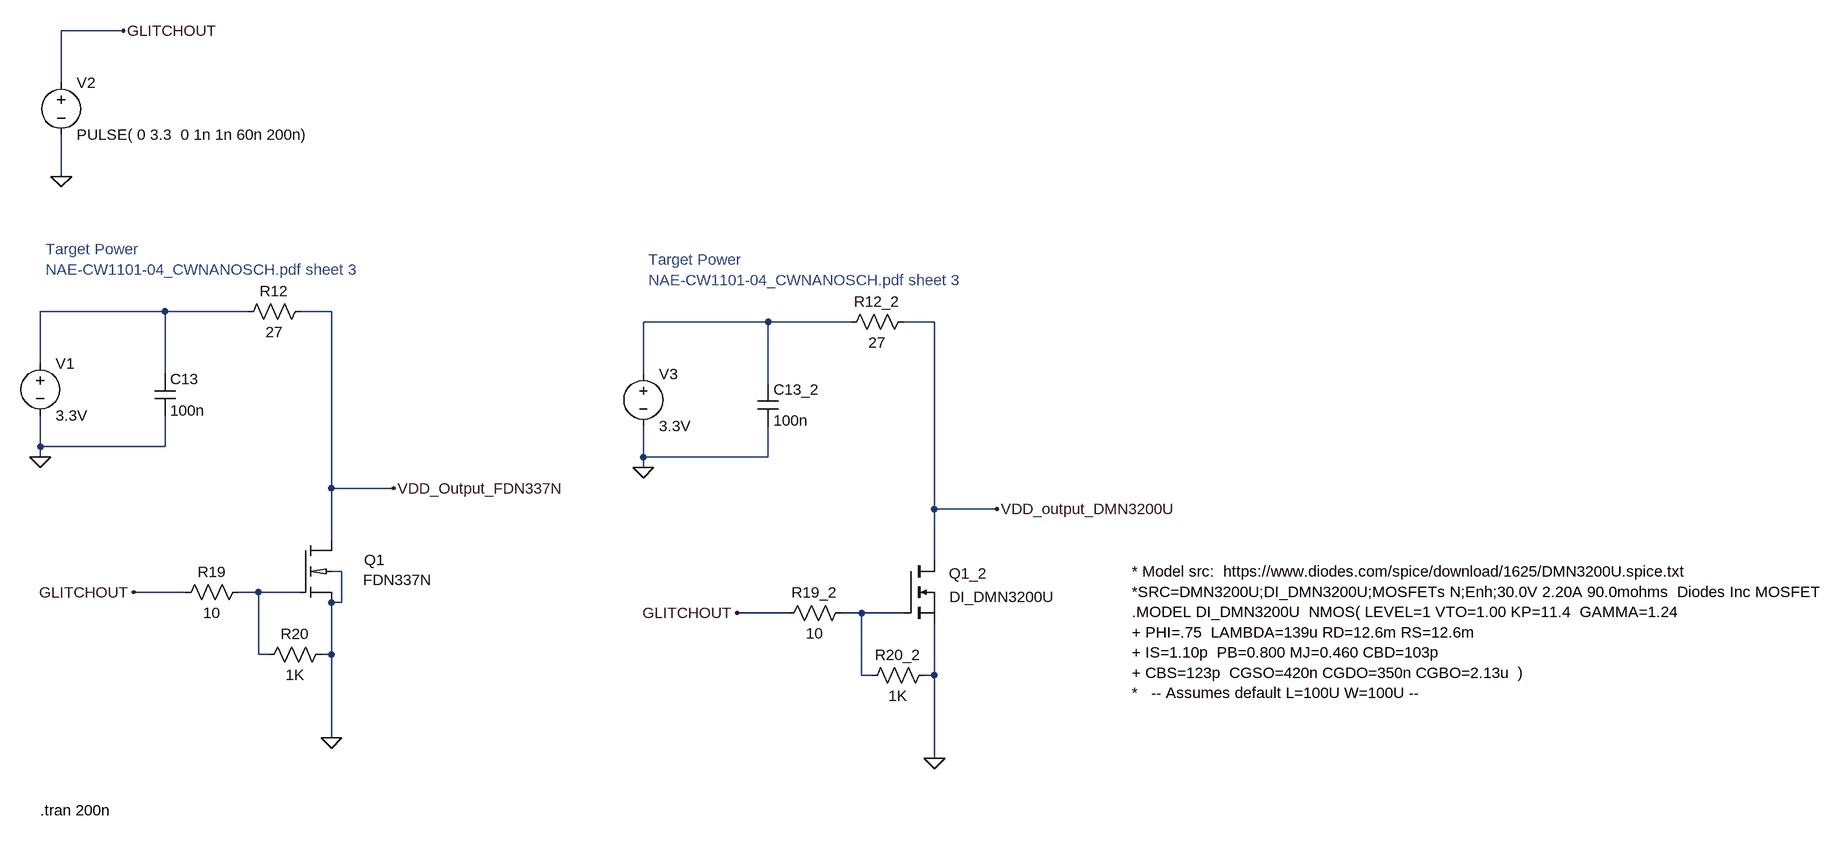
[diagram p0: schematic cw_nano_glitch_sim.asc]
cw_nano_glitch_sim.asc, the LTspice schematic file:
Version 4
SHEET 1 2692 1140
WIRE -592 -576 -688 -576
WIRE -688 -496 -688 -576
WIRE -688 -352 -688 -416
WIRE -528 -144 -720 -144
WIRE -400 -144 -528 -144
WIRE -272 -144 -320 -144
WIRE 400 -128 208 -128
WIRE 528 -128 400 -128
WIRE 656 -128 608 -128
WIRE -720 -64 -720 -144
WIRE -528 -48 -528 -144
WIRE 208 -48 208 -128
WIRE 400 -32 400 -128
WIRE -720 64 -720 16
WIRE -528 64 -528 16
WIRE -528 64 -720 64
WIRE -720 80 -720 64
WIRE 208 80 208 32
WIRE 400 80 400 32
WIRE 400 80 208 80
WIRE 208 96 208 80
WIRE -272 128 -272 -144
WIRE -176 128 -272 128
WIRE 656 160 656 -128
WIRE 752 160 656 160
WIRE -272 208 -272 128
WIRE 656 240 656 160
WIRE -256 256 -272 256
WIRE -496 288 -576 288
WIRE -384 288 -416 288
WIRE -320 288 -384 288
WIRE -256 304 -256 256
WIRE -256 304 -272 304
WIRE 432 320 352 320
WIRE 544 320 512 320
WIRE 608 320 544 320
WIRE -384 384 -384 288
WIRE -368 384 -384 384
WIRE -272 384 -272 304
WIRE -272 384 -288 384
WIRE 544 416 544 320
WIRE 560 416 544 416
WIRE 656 416 656 336
WIRE 656 416 640 416
WIRE -272 512 -272 384
WIRE 656 544 656 416
FLAG -720 80 0
FLAG -688 -352 0
FLAG -592 -576 GLITCHOUT
FLAG -176 128 VDD_Output_FDN337N
FLAG -272 512 0
FLAG 752 160 VDD_output_DMN3200U
FLAG 656 544 0
FLAG 208 96 0
FLAG 352 320 GLITCHOUT
FLAG -576 288 GLITCHOUT
SYMBOL voltage -720 -80 R0
WINDOW 123 0 0 Left 0
WINDOW 39 0 0 Left 0
SYMATTR InstName V1
SYMATTR Value 3.3V
SYMBOL voltage -688 -512 R0
WINDOW 123 0 0 Left 0
WINDOW 39 0 0 Left 0
SYMATTR InstName V2
SYMATTR Value PULSE( 0 3.3  0 1n 1n 60n 200n)
SYMBOL res -272 368 R90
WINDOW 0 0 56 VBottom 2
WINDOW 3 32 56 VTop 2
SYMATTR InstName R20
SYMATTR Value 1K
SYMBOL res -400 272 R90
WINDOW 0 0 56 VBottom 2
WINDOW 3 32 56 VTop 2
SYMATTR InstName R19
SYMATTR Value 10
SYMBOL cap -544 -48 R0
SYMATTR InstName C13
SYMATTR Value 100n
SYMBOL res -304 -160 R90
WINDOW 0 0 56 VBottom 2
WINDOW 3 32 56 VTop 2
SYMATTR InstName R12
SYMATTR Value 27
SYMBOL nmos 608 240 R0
WINDOW 0 130 19 Right 2
WINDOW 3 235 55 Right 2
SYMATTR InstName Q1_2
SYMATTR Value DI_DMN3200U
SYMBOL res 656 400 R90
WINDOW 0 0 56 VBottom 2
WINDOW 3 32 56 VTop 2
SYMATTR InstName R20_2
SYMATTR Value 1K
SYMBOL res 528 304 R90
WINDOW 0 0 56 VBottom 2
WINDOW 3 32 56 VTop 2
SYMATTR InstName R19_2
SYMATTR Value 10
SYMBOL voltage 208 -64 R0
WINDOW 123 0 0 Left 0
WINDOW 39 0 0 Left 0
SYMATTR InstName V3
SYMATTR Value 3.3V
SYMBOL cap 384 -32 R0
SYMATTR InstName C13_2
SYMATTR Value 100n
SYMBOL res 624 -144 R90
WINDOW 0 0 56 VBottom 2
WINDOW 3 32 56 VTop 2
SYMATTR InstName R12_2
SYMATTR Value 27
SYMBOL FDN337N -320 208 R0
WINDOW 0 98 30 Left 2
WINDOW 3 97 61 Left 2
SYMATTR InstName Q1
TEXT -720 624 Left 2 !.tran 200n
TEXT -712 -240 Left 2 ;Target Power \nNAE-CW1101-04_CWNANOSCH.pdf sheet 3
TEXT 216 -224 Left 2 ;Target Power \nNAE-CW1101-04_CWNANOSCH.pdf sheet 3
TEXT 960 256 Left 2 !* Model src:  https://www.diodes.com/spice/download/1625/DMN3200U.spice.txt\n*SRC=DMN3200U;DI_DMN3200U;MOSFETs N;Enh;30.0V 2.20A 90.0mohms  Diodes Inc MOSFET\n.MODEL DI_DMN3200U  NMOS( LEVEL=1 VTO=1.00 KP=11.4  GAMMA=1.24\n+ PHI=.75  LAMBDA=139u RD=12.6m RS=12.6m\n+ IS=1.10p  PB=0.800 MJ=0.460 CBD=103p \n+ CBS=123p  CGSO=420n CGDO=350n CGBO=2.13u  )\n*   -- Assumes default L=100U W=100U --

The netlist it stands for:
* cw_nano_glitch_sim.asc
V1 N001 0 3.3V
V2 GLITCHOUT 0 PULSE( 0 3.3  0 1n 1n 60n 200n)
R20 0 N003 1K
R19 N003 GLITCHOUT 10
C13 N001 0 100n
R12 VDD_Output_FDN337N N001 27
M§Q1_2 VDD_output_DMN3200U N004 0 0 DI_DMN3200U
R20_2 0 N004 1K
R19_2 N004 GLITCHOUT 10
V3 N002 0 3.3V
C13_2 N002 0 100n
R12_2 VDD_output_DMN3200U N002 27
XQ1 VDD_Output_FDN337N N003 0 0 FDN337N  ; pins D G S B
.model NMOS NMOS
.model PMOS PMOS
.lib standard.mos
.tran 200n
* Target Power
* NAE-CW1101-04_CWNANOSCH.pdf sheet 3
* Target Power
* NAE-CW1101-04_CWNANOSCH.pdf sheet 3
* Model src:  https://www.diodes.com/spice/download/1625/DMN3200U.spice.txt
*SRC=DMN3200U;DI_DMN3200U;MOSFETs N;Enh;30.0V 2.20A 90.0mohms  Diodes Inc MOSFET
.MODEL DI_DMN3200U  NMOS( LEVEL=1 VTO=1.00 KP=11.4  GAMMA=1.24
+ PHI=.75  LAMBDA=139u RD=12.6m RS=12.6m
+ IS=1.10p  PB=0.800 MJ=0.460 CBD=103p
+ CBS=123p  CGSO=420n CGDO=350n CGBO=2.13u  )
*   -- Assumes default L=100U W=100U --
.lib FDN337N.lib
.backanno
.end